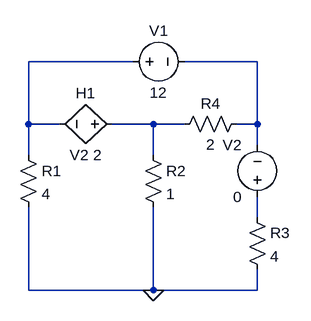
[diagram p0: schematic Draft24.asc]
Draft24.asc, the LTspice schematic file:
Version 4
SHEET 1 880 680
WIRE 176 16 16 16
WIRE 368 16 256 16
WIRE 16 112 16 16
WIRE 64 112 16 112
WIRE 208 112 144 112
WIRE 256 112 208 112
WIRE 368 112 368 16
WIRE 368 112 336 112
WIRE 368 144 368 112
WIRE 16 160 16 112
WIRE 208 160 208 112
WIRE 368 256 368 224
WIRE 16 368 16 240
WIRE 208 368 208 240
WIRE 208 368 16 368
WIRE 368 368 368 336
WIRE 368 368 208 368
FLAG 208 368 0
SYMBOL voltage 160 16 R270
WINDOW 0 32 56 VTop 2
WINDOW 3 -32 56 VBottom 2
SYMATTR InstName V1
SYMATTR Value 12
SYMBOL h 160 112 R90
WINDOW 0 -32 56 VBottom 2
WINDOW 3 32 56 VTop 2
SYMATTR InstName H1
SYMATTR Value V2 2
SYMBOL res 0 144 R0
SYMATTR InstName R1
SYMATTR Value 4
SYMBOL res 192 144 R0
SYMATTR InstName R2
SYMATTR Value 1
SYMBOL res 352 96 R90
WINDOW 0 0 56 VBottom 2
WINDOW 3 32 56 VTop 2
SYMATTR InstName R4
SYMATTR Value 2
SYMBOL voltage 368 240 R180
WINDOW 0 24 96 Left 2
WINDOW 3 24 16 Left 2
SYMATTR InstName V2
SYMATTR Value 0
SYMBOL res 352 240 R0
SYMATTR InstName R3
SYMATTR Value 4

The netlist it stands for:
* Draft24.asc
V1 N001 N002 12
H1 N003 N001 V2 2
R1 N001 0 4
R2 N003 0 1
R4 N002 N003 2
V2 N004 N002 0
R3 N004 0 4
.backanno
.end